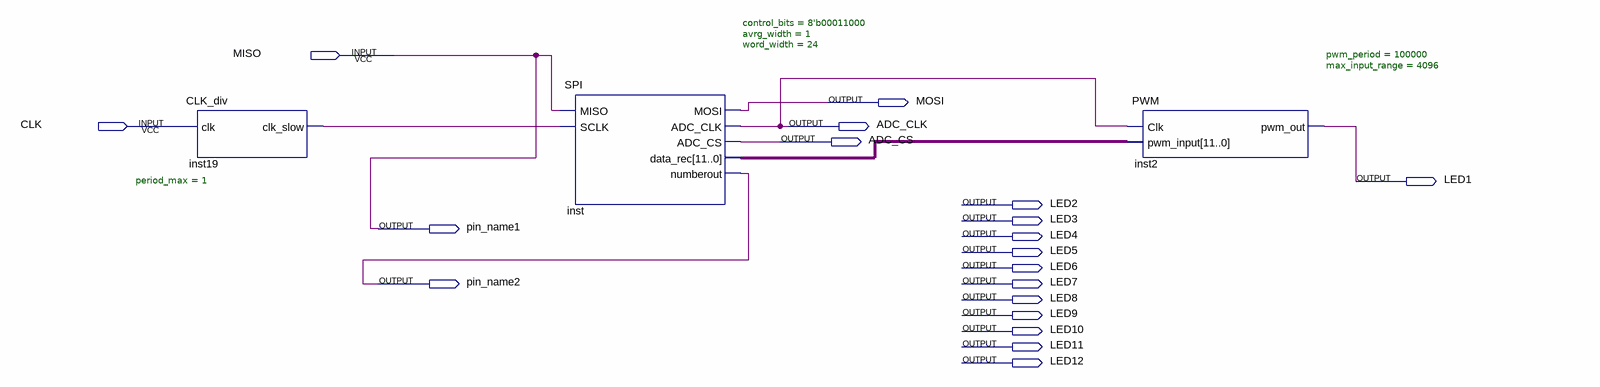
[diagram p0: schematic sheet]
// Quartus schematic licence_project_old.bdf as structural Verilog: 3 symbols, 19 pins
module licence_project_old (
  input  MISO,
  input  CLK,
  output MOSI,
  output ADC_CLK,
  output ADC_CS,
  output LED1,
  output LED2,
  output LED3,
  output pin_name1,
  output LED4,
  output LED5,
  output LED6,
  output pin_name2,
  output LED7,
  output LED8,
  output LED9,
  output LED10,
  output LED11,
  output LED12
);

  wire inst19_clk_slow;
  wire [11:0] inst_data_rec;

  CLK_div #(.period_max(1)) inst19 (.clk(CLK), .clk_slow(inst19_clk_slow));
  SPI #(.control_bits(8'b00011000), .avrg_width(1), .word_width(24)) inst (
    .MISO(MISO), .SCLK(inst19_clk_slow), .MOSI(MOSI), .ADC_CLK(ADC_CLK), .ADC_CS(ADC_CS),
    .data_rec(inst_data_rec), .numberout(pin_name2));
  PWM #(.pwm_period(100000), .max_input_range(4096)) inst2 (.Clk(ADC_CLK), .pwm_input(inst_data_rec), .pwm_out(LED1));

  assign pin_name1 = MISO;
endmodule
